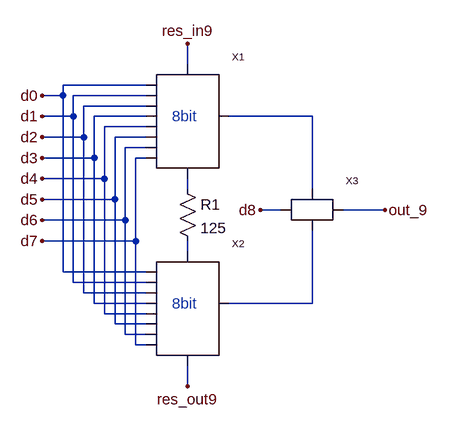
[diagram p0: schematic level8.asc]
level8.asc, the LTspice schematic file:
Version 4
SHEET 1 880 680
WIRE 144 32 144 0
WIRE 80 64 -48 64
WIRE -48 80 -48 64
WIRE -48 80 -80 80
WIRE 80 80 -32 80
WIRE 80 96 -16 96
WIRE -32 112 -32 80
WIRE -32 112 -80 112
WIRE 80 112 0 112
WIRE 336 112 208 112
WIRE 80 128 16 128
WIRE -16 144 -16 96
WIRE -16 144 -80 144
WIRE 80 144 32 144
WIRE 80 160 48 160
WIRE 0 176 0 112
WIRE 0 176 -80 176
WIRE 80 176 64 176
WIRE 16 208 16 128
WIRE 16 208 -80 208
WIRE 144 224 144 208
WIRE 336 224 336 112
WIRE 32 240 32 144
WIRE 32 240 -80 240
WIRE 288 256 256 256
WIRE 448 256 384 256
WIRE 48 272 48 160
WIRE 48 272 -80 272
WIRE 64 304 64 176
WIRE 64 304 -80 304
WIRE 144 320 144 304
WIRE -48 352 -48 80
WIRE 80 352 -48 352
WIRE -32 368 -32 112
WIRE 80 368 -32 368
WIRE -16 384 -16 144
WIRE 80 384 -16 384
WIRE 0 400 0 176
WIRE 80 400 0 400
WIRE 336 400 336 288
WIRE 336 400 208 400
WIRE 16 416 16 208
WIRE 80 416 16 416
WIRE 32 432 32 240
WIRE 80 432 32 432
WIRE 48 448 48 272
WIRE 80 448 48 448
WIRE 64 464 64 304
WIRE 80 464 64 464
WIRE 144 528 144 496
FLAG -80 80 d0
FLAG -80 112 d1
FLAG -80 144 d2
FLAG -80 176 d3
FLAG -80 208 d4
FLAG -80 240 d5
FLAG -80 272 d6
FLAG 256 256 d8
FLAG 448 256 out_9
FLAG 144 0 res_in9
FLAG 144 528 res_out9
FLAG -80 304 d7
SYMBOL level7 144 112 R0
SYMATTR InstName X1
SYMBOL level7 144 400 R0
SYMATTR InstName X2
SYMBOL switch 336 256 R0
SYMATTR InstName X3
SYMBOL res 128 208 R0
SYMATTR InstName R1
SYMATTR Value 125
TEXT 120 112 Left 2 ;8bit
TEXT 120 400 Left 2 ;8bit

The netlist it stands for:
* level8.asc
XX1 d0 d1 d2 d3 d4 d5 d6 d7 N002 N001 res_in9 level7  ; pins d0 d1 d2 d3 d4 d5 d6 d7 res_out8 out_8 res_in8
XX2 d0 d1 d2 d3 d4 d5 d6 d7 res_out9 N004 N003 level7  ; pins d0 d1 d2 d3 d4 d5 d6 d7 res_out8 out_8 res_in8
XX3 d8 N001 N004 out_9 switch  ; pins dig_in in_1 in_2 Vout
R1 N002 N003 125
* 8bit
* 8bit
.backanno
.end